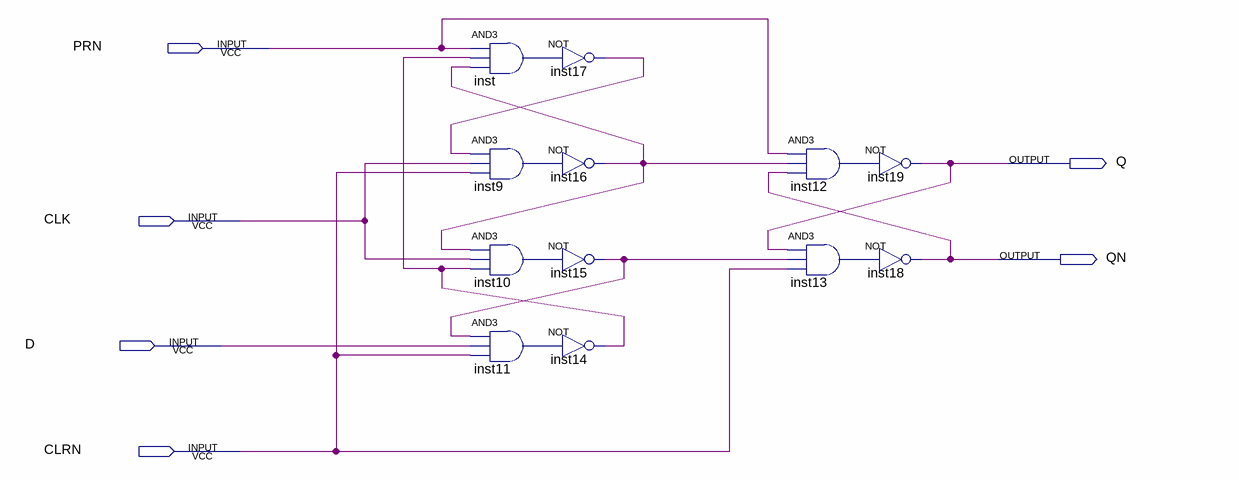
[diagram p0: schematic sheet]
// Quartus schematic myDFF.bdf as structural Verilog: 12 symbols, 6 pins
module myDFF (
  input  PRN,
  input  CLK,
  input  D,
  input  CLRN,
  output Q,
  output QN
);

  wire inst9_out, inst10_out, inst11_out, inst12_out, inst13_out, inst14_out, inst15_out, inst16_out,
       inst17_out, inst_out;

  and inst (inst_out, PRN, inst14_out, inst16_out);
  and inst9 (inst9_out, inst17_out, CLK, CLRN);
  and inst10 (inst10_out, inst16_out, CLK, inst14_out);
  and inst11 (inst11_out, inst15_out, D, CLRN);
  not inst17 (inst17_out, inst_out);
  not inst16 (inst16_out, inst9_out);
  not inst15 (inst15_out, inst10_out);
  not inst14 (inst14_out, inst11_out);
  and inst12 (inst12_out, PRN, inst16_out, QN);
  and inst13 (inst13_out, Q, inst15_out, CLRN);
  not inst19 (Q, inst12_out);
  not inst18 (QN, inst13_out);
endmodule
